# EAGLE design IEEEcounter (EAGLE 9.5.1)
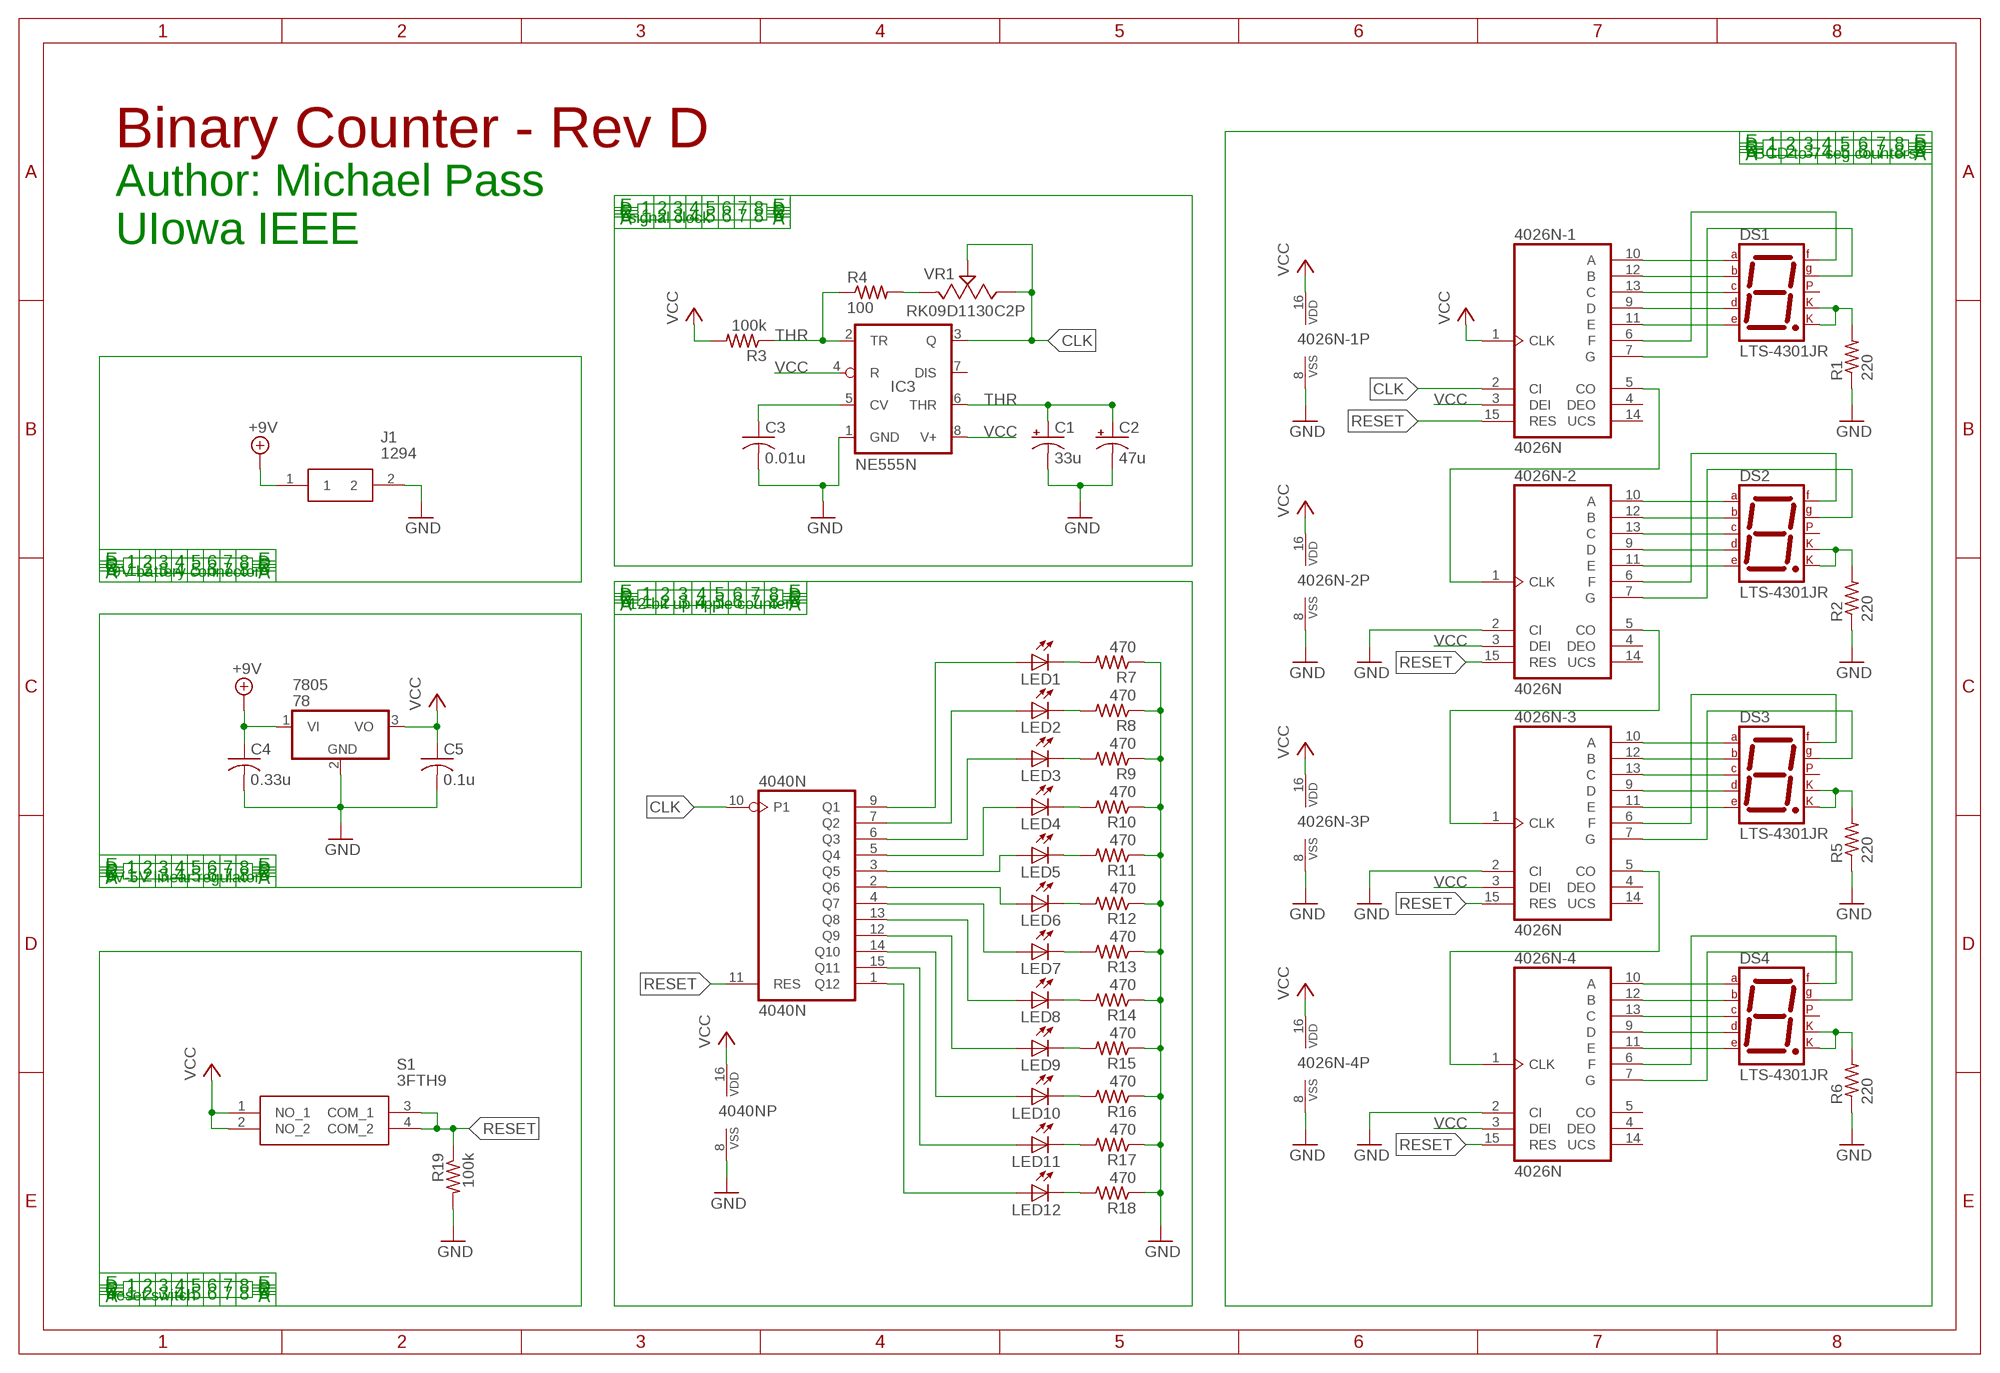
[diagram p0: schematic, sheet 1]

## Parts
4026N-1  4026N  [DIL16]
4026N-2  4026N  [DIL16]
4026N-3  4026N  [DIL16]
4026N-4  4026N  [DIL16]
4040N  4040N  [DIL16]
7805  78  [TO220H]
C1  33u  CPOL-USE2.5-6  [E2,5-6]
C2  47u  CPOL-USE2.5-6  [E2,5-6]
C3  0.01u  C-US050-025X075  [C050-025X075]
C4  0.33u  C-USC1210  [C1210]
C5  0.1u  C-USC1210  [C1210]
DS1  LTS-4301JR  [DIPS762W50P254L1290H700Q10N]
DS2  LTS-4301JR  [DIPS762W50P254L1290H700Q10N]
DS3  LTS-4301JR  [DIPS762W50P254L1290H700Q10N]
DS4  LTS-4301JR  [DIPS762W50P254L1290H700Q10N]
IC3  NE555N  [DIL08]
J1  1294  [1294]
LED1  LED5MM  [LED5MM]
LED2  LED5MM  [LED5MM]
LED3  LED5MM  [LED5MM]
LED4  LED5MM  [LED5MM]
LED5  LED5MM  [LED5MM]
LED6  LED5MM  [LED5MM]
LED7  LED5MM  [LED5MM]
LED8  LED5MM  [LED5MM]
LED9  LED5MM  [LED5MM]
LED10  LED5MM  [LED5MM]
LED11  LED5MM  [LED5MM]
LED12  LED5MM  [LED5MM]
R1  220  R-US_R1210  [R1210]
R2  220  R-US_R1210  [R1210]
R3  100k  R-US_R1210  [R1210]
R4  100  R-US_R1210  [R1210]
R5  220  R-US_R1210  [R1210]
R6  220  R-US_R1210  [R1210]
R7  470  R-US_R1210  [R1210]
R8  470  R-US_R1210  [R1210]
R9  470  R-US_R1210  [R1210]
R10  470  R-US_R1210  [R1210]
R11  470  R-US_R1210  [R1210]
R12  470  R-US_R1210  [R1210]
R13  470  R-US_R1210  [R1210]
R14  470  R-US_R1210  [R1210]
R15  470  R-US_R1210  [R1210]
R16  470  R-US_R1210  [R1210]
R17  470  R-US_R1210  [R1210]
R18  470  R-US_R1210  [R1210]
R19  100k  R-US_R1210  [R1210]
S1  3FTH9  [3FTH9]
VR1  RK09D1130C2P  [RK09D1130C3C]

## Nets
+9V: 7805.1(VI) C4.1 J1.1
CLK: 4026N-1.2(CI) 4040N.10(P1) IC3.3(Q) VR1.2 VR1.3
GND: 4026N-1.8(VSS) 4026N-2.2(CI) 4026N-2.8(VSS) 4026N-3.2(CI) 4026N-3.8(VSS) 4026N-4.2(CI) 4026N-4.8(VSS) 4040N.8(VSS) 7805.2(GND) C1.- C2.- C3.2 C4.2 C5.2 IC3.1(GND) J1.2 R1.1 R2.1 R5.1 R6.1 R7.1 R8.1 R9.1 R10.1 R11.1 R12.1 R13.1 R14.1 R15.1 R16.1 R17.1 R18.1 R19.2
N$1: 4026N-1.6(F) DS1.2(F)
N$2: 4026N-1.7(G) DS1.1(G)
N$3: 4026N-1.10(A) DS1.10(A)
N$4: 4026N-1.12(B) DS1.9(B)
N$5: 4026N-1.13(C) DS1.7(C)
N$6: 4026N-1.9(D) DS1.5(D)
N$7: 4026N-1.11(E) DS1.4(E)
N$8: DS1.3(CK1) DS1.8(CK2) R1.2
N$9: R4.2 VR1.1
N$10: C3.1 IC3.5(CV)
N$11: LED11.K(C) R17.2
N$12: 4040N.9(Q1) LED1.A
N$13: 4040N.7(Q2) LED2.A
N$14: 4040N.6(Q3) LED3.A
N$15: 4040N.5(Q4) LED4.A
N$16: LED12.K(C) R18.2
N$17: LED10.K(C) R16.2
N$18: LED9.K(C) R15.2
N$19: LED8.K(C) R14.2
N$20: LED7.K(C) R13.2
N$21: LED6.K(C) R12.2
N$22: LED5.K(C) R11.2
N$23: LED4.K(C) R10.2
N$24: LED3.K(C) R9.2
N$25: LED2.K(C) R8.2
N$26: LED1.K(C) R7.2
N$27: 4040N.3(Q5) LED5.A
N$28: 4040N.2(Q6) LED6.A
N$29: 4040N.4(Q7) LED7.A
N$30: 4040N.13(Q8) LED8.A
N$31: 4040N.12(Q9) LED9.A
N$32: 4040N.14(Q10) LED10.A
N$33: 4040N.15(Q11) LED11.A
N$34: 4040N.1(Q12) LED12.A
N$35: 4026N-2.6(F) DS2.2(F)
N$36: 4026N-2.7(G) DS2.1(G)
N$37: 4026N-2.10(A) DS2.10(A)
N$38: 4026N-2.12(B) DS2.9(B)
N$39: 4026N-2.13(C) DS2.7(C)
N$40: 4026N-2.9(D) DS2.5(D)
N$41: 4026N-2.11(E) DS2.4(E)
N$42: DS2.3(CK1) DS2.8(CK2) R2.2
N$43: 4026N-3.6(F) DS3.2(F)
N$44: 4026N-3.7(G) DS3.1(G)
N$45: 4026N-3.10(A) DS3.10(A)
N$46: 4026N-3.12(B) DS3.9(B)
N$47: 4026N-3.13(C) DS3.7(C)
N$48: 4026N-3.9(D) DS3.5(D)
N$49: 4026N-3.11(E) DS3.4(E)
N$50: DS3.3(CK1) DS3.8(CK2) R5.2
N$51: 4026N-4.6(F) DS4.2(F)
N$52: 4026N-4.7(G) DS4.1(G)
N$53: 4026N-4.10(A) DS4.10(A)
N$54: 4026N-4.12(B) DS4.9(B)
N$55: 4026N-4.13(C) DS4.7(C)
N$56: 4026N-4.9(D) DS4.5(D)
N$57: 4026N-4.11(E) DS4.4(E)
N$58: DS4.3(CK1) DS4.8(CK2) R6.2
N$59: 4026N-1.5(CO) 4026N-2.1(CLK)
N$60: 4026N-2.5(CO) 4026N-3.1(CLK)
N$61: 4026N-3.5(CO) 4026N-4.1(CLK)
RESET: 4026N-1.15(RES) 4026N-2.15(RES) 4026N-3.15(RES) 4026N-4.15(RES) 4040N.11(RES) R19.1 S1.3(COM_1) S1.4(COM_2)
THR: C1.+ C2.+ IC3.2(TR) IC3.6(THR) R3.1 R4.1
VCC: 4026N-1.1(CLK) 4026N-1.3(DEI) 4026N-1.16(VDD) 4026N-2.3(DEI) 4026N-2.16(VDD) 4026N-3.3(DEI) 4026N-3.16(VDD) 4026N-4.3(DEI) 4026N-4.16(VDD) 4040N.16(VDD) 7805.3(VO) C5.1 IC3.4(R) IC3.8(V+) R3.2 S1.1(NO_1) S1.2(NO_2)
Unconnected: 4026N-1.4(DEO) 4026N-1.14(UCS) 4026N-2.4(DEO) 4026N-2.14(UCS) 4026N-3.4(DEO) 4026N-3.14(UCS) 4026N-4.4(DEO) 4026N-4.5(CO) 4026N-4.14(UCS) DS1.6(DP) DS2.6(DP) DS3.6(DP) DS4.6(DP) IC3.7(DIS)

## Notes on the sheet
- Binary Counter - Rev D | BCD-to-7 seg counters
- Author: Michael Pass
- signal clock
- UIowa IEEE
- 9V battery connector
- 12-bit up ripple counter
- 9V-5V linear regulator
- reset switch

## Library data of the parts
4026N-1-4026N-4 = 40xx:4026: Decade COUNTER/DIVIDER, 7-seg. outputs
4040N = 40xx:4040: 12-stage binary/ripple COUNTER
7805 = IEEEcounter:78*
C1 C2 = rcl:CPOL-US: POLARIZED CAPACITOR, American symbol; SPICEPREFIX: C
C3-C5 = rcl:C-US: CAPACITOR, American symbol; SPICEPREFIX: C
DS1-DS4 = LTS-4301JR:LTS-4301JR: LED Displays & Accessories 1-DIG Red CCRHD Source: Datasheet <https://componentsearchengine.com/Datasheets/1/LTS-4301JR.pdf>; DESCRIPTION: LED Displays & Accessories 1-DIG Red CCRHD; HEIGHT: 7mm; MANUFACTURER_NAME: Lite-On; MANUFACTURER_PART_NUMBER: LTS-4301JR; MOUSER_PART_NUMBER: 859-LTS-4301JR; MOUSER_PRICE-STOCK: https://www.mouser.com/Search/Refine.aspx?Keyword=859-LTS-4301JR
IC3 = linear:*555: TIMER
J1 = 1294:1294: BATTERY HOLDER PP3 Keystone PCB Mount Battery Holder for 1, Solder Tag Contact Source: Datasheet <http://docs-emea.rs-online.com/webdocs/13d4/0900766b813d4cac.pdf>; ALLIED_NUMBER: 70182303; ALLIED_PRICE-STOCK: http://www.alliedelec.com/keystone-electronics-1294/70182303/; DESCRIPTION: BATTERY HOLDER PP3 Keystone PCB Mount Battery Holder for 1, Solder Tag Contact; HEIGHT: mm; MANUFACTURER_NAME: Keystone Electronics; MANUFACTURER_PART_NUMBER: 1294; MOUSER_PART_NUMBER: 534-1294; MOUSER_PRICE-STOCK: https://www.mouser.com/Search/Refine.aspx?Keyword=534-1294; RS_PART_NUMBER: 1725845; RS_PRICE-STOCK: http://uk.rs-online.com/web/p/products/1725845
LED1-LED12 = SparkFun:LED: LEDs Standard schematic elements and footprints for 5mm, 3mm, 1206, and 0603 sized LEDs. 5mm - Spark Fun Electronics SKU : COM-00529 (and others)
R1-R19 = rcl:R-US_: RESISTOR, American symbol; SPICEPREFIX: R
S1 = 3FTH9:3FTH9: IP67 Black Cap Tactile Switch, Single Pole Single Throw (SPST) 50 mA 4mm Through Hole Source: Datasheet <https://componentsearchengine.com/Datasheets/1/3FTH9.pdf>; DESCRIPTION: IP67 Black Cap Tactile Switch, Single Pole Single Throw (SPST) 50 mA 4mm Through Hole; HEIGHT: 10.4mm; MANUFACTURER_NAME: Apem; MANUFACTURER_PART_NUMBER: 3FTH9; MOUSER_PART_NUMBER: 642-3FTH9; MOUSER_PRICE-STOCK: https://www.mouser.com/Search/Refine.aspx?Keyword=642-3FTH9
VR1 = RK09D1130C2P:RK09D1130C2P: Alps Electric 1 Gang Rotary Potentiometer with a 6 mm Dia. Shaft, 10k, +/-20%, 0.05W, Linear RK09D1130C2P Source: Datasheet <https://www.alps.com/prod/info/E/HTML/Potentiometer/RotaryPotentiometers/RK09K/RK09D1130C2P.html>; ALLIED_NUMBER: R1075936; ALLIED_PRICE-STOCK: https://www.alliedelec.com/alps-rk09d1130c2p/R1075936/; DESCRIPTION: Alps Electric 1 Gang Rotary Potentiometer with a 6 mm Dia. Shaft, 10k, +/-20%, 0.05W, Linear RK09D1130C2P; HEIGHT: mm; MANUFACTURER_NAME: ALPS; MANUFACTURER_PART_NUMBER: RK09D1130C2P; MOUSER_PART_NUMBER: 688-RK09D1130C2P; MOUSER_PRICE-STOCK: https://www.mouser.com/Search/Refine.aspx?Keyword=688-RK09D1130C2P; RS_PART_NUMBER: 1726272; RS_PRICE-STOCK: http://uk.rs-online.com/web/p/products/1726272

## Board
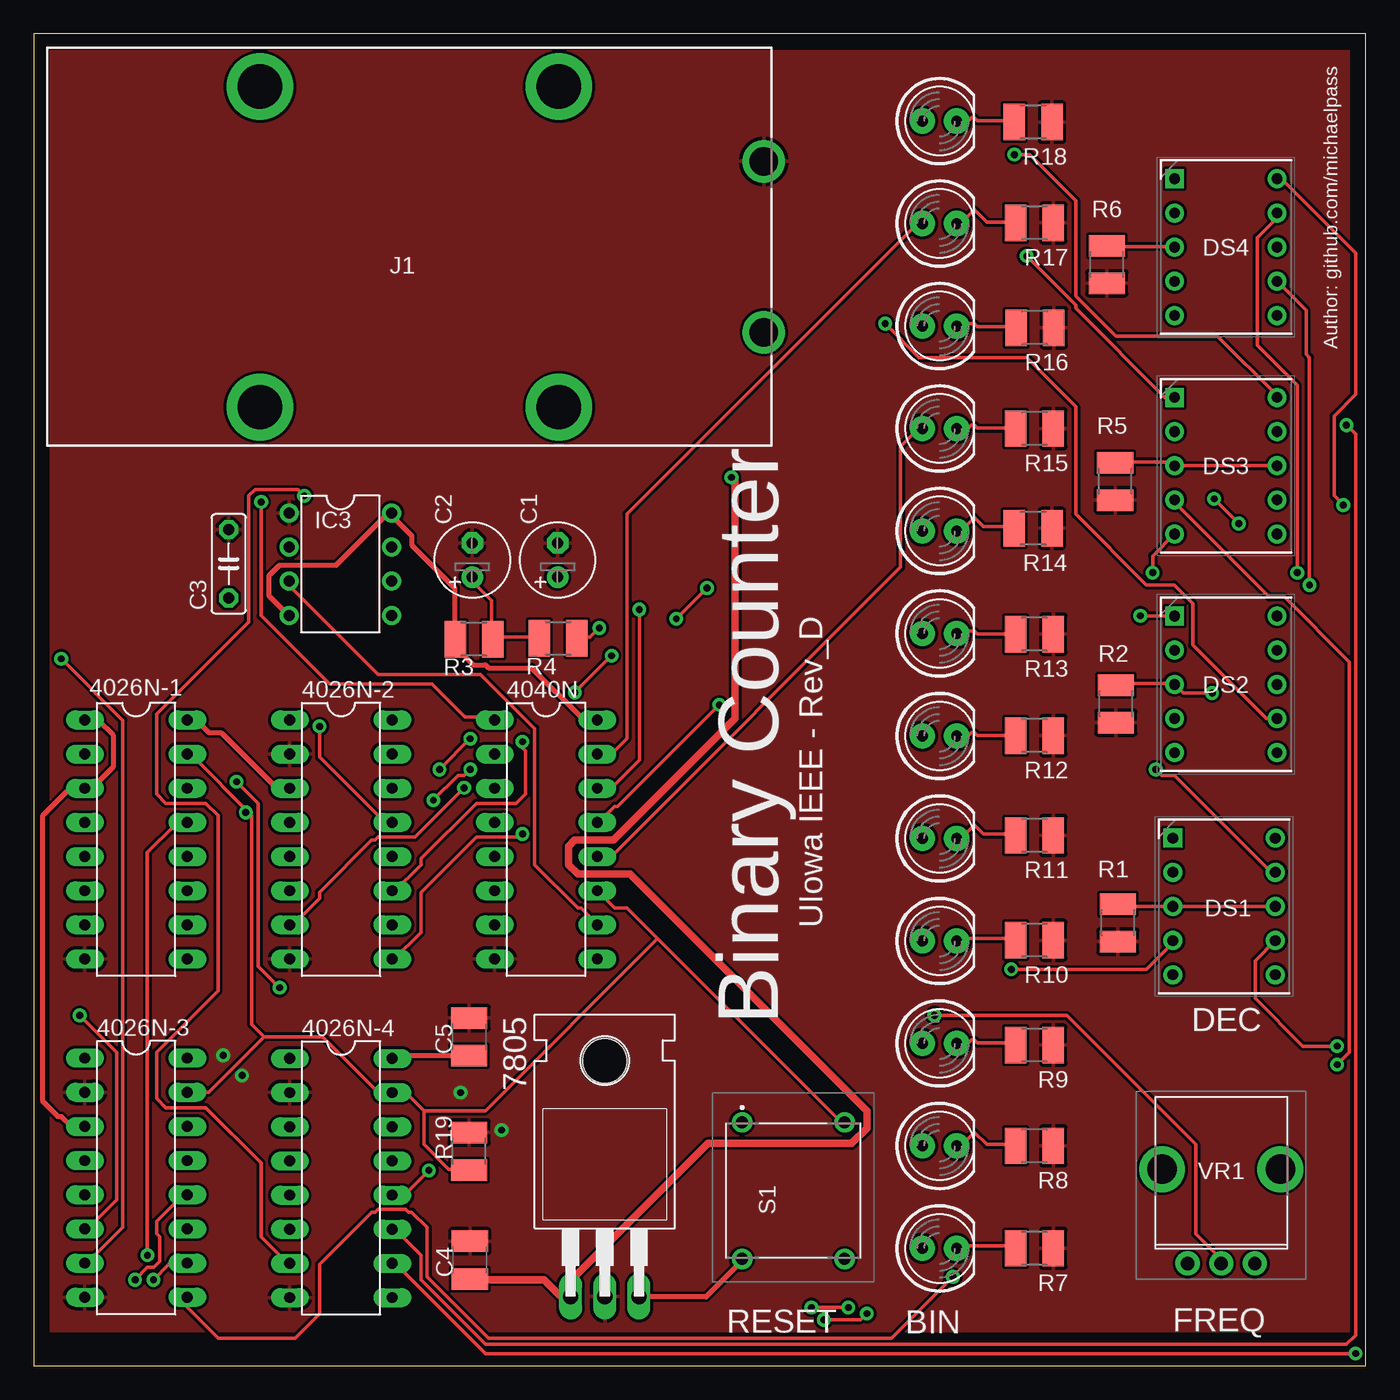
[diagram p1: board, top side]
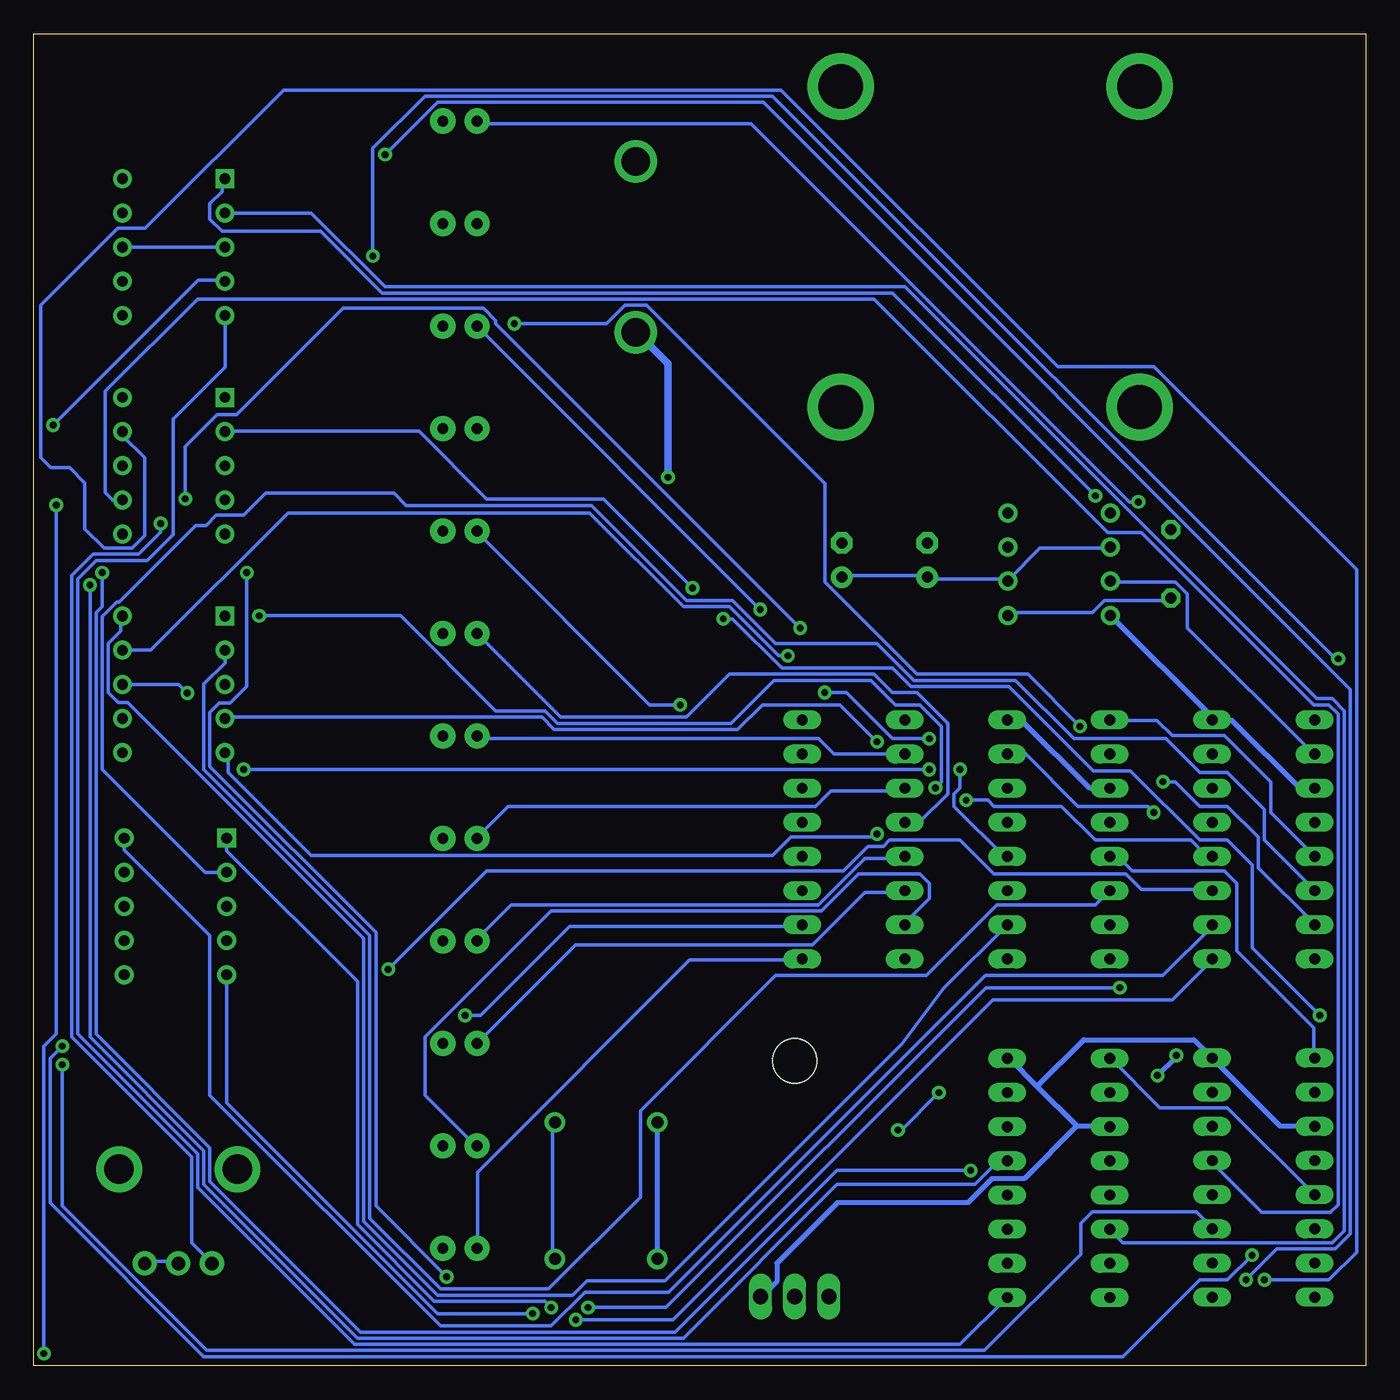
[diagram p2: board, bottom side, seen from below]

Size 99.06 x 99.06 mm. Coordinates in mm from the lower left corner, seen from the top.
Outline: 0,0 99.06,0 99.06,99.06 0,99.06 0,0
Copper layers (1*16): Top 0.035mm / dielectric 1.5mm / Bottom 0.035mm
Design rules "SparkFun *": minimum track width 10mil, minimum drill 20mil, track to track 8mil, track to pad 8mil, pad to pad 8mil, via to via 8mil, smd to smd 8mil, copper to edge 10mil, drill to drill 8mil, minimum pad ring 12mil, minimum via ring 10mil, stop-mask expansion 4mil, vias tented up to drill 25mil, thermal gap 10mil

### Footprints (pad centres in the part's own frame; a part is rotated, then mirrored left to right if it is on the bottom)
DIL16 = drill 0.813 long: 1 -8.89,-3.81; 2 -6.35,-3.81; 3 -3.81,-3.81; 4 -1.27,-3.81; 5 1.27,-3.81; 6 3.81,-3.81; 7 6.35,-3.81; 8 8.89,-3.81; 9 8.89,3.81; 10 6.35,3.81; 11 3.81,3.81; 12 1.27,3.81; 13 -1.27,3.81; 14 -3.81,3.81; 15 -6.35,3.81; 16 -8.89,3.81
TO220H = drill 1.118 long: 1 -2.54,-12.7; 2 0,-12.7; 3 2.54,-12.7 | hole 3.302: 0,4.826
E2,5-6 = drill 0.813 pad 1.6: + -1.27,0 | drill 0.813 pad 1.6 octagon: - 1.27,0
C050-025X075 = drill 0.813 octagon: 1 -2.54,0; 2 2.54,0
C1210 = smd 1.6 x 2.7: 1 -1.4,0; 2 1.4,0
DIPS762W50P254L1290H700Q10N = drill 0.8 pad 1.2 square: 1 0,0 | drill 0.8 pad 1.2: 2 0,-2.54; 3 0,-5.08; 4 0,-7.62; 5 0,-10.16; 6 7.62,-10.16; 7 7.62,-7.62; 8 7.62,-5.08; 9 7.62,-2.54; 10 7.62,0
DIL08 = drill 0.813 pad 1.27: 1 -3.81,-3.81; 2 -1.27,-3.81; 3 1.27,-3.81; 4 3.81,-3.81; 5 3.81,3.81; 6 1.27,3.81; 7 -1.27,3.81; 8 -3.81,3.81
1294 = drill 2.11 pad 3.16: 1 -26.355,18.265; 2 -26.355,5.565 | drill 3.3 pad 4.95: 3 -11.115,23.83; 4 -11.115,0; 5 11.115,23.83; 6 11.115,0
LED5MM = drill 0.813 pad 1.88: A -1.27,0; K 1.27,0
R1210 = smd 1.6 x 2.7: 1 -1.4,0; 2 1.4,0
3FTH9 = drill 0.9 pad 1.4: 1 0,0; 2 -10.16,0; 3 0,-7.62; 4 -10.16,-7.62
RK09D1130C3C = drill 1 pad 1.8: 1 0,0; 2 2.5,0; 3 5,0 | drill 2.2 pad 3.4: 4 -1.9,7; 5 6.9,7

### Placement (x,y rotation side)
4026N-1  7.62,39.14 270 top
4026N-2  22.86,39.14 270 top
4026N-3  7.62,14 270 top
4026N-4  22.86,13.97 270 top
4040N  38.1,39.14 270 top
7805  42.47,17.86 0 top
C1  38.96,59.92 90 top
C2  32.61,59.92 90 top
C3  14.5,59.64 90 top
C4  32.44,7.87 90 top
C5  32.38,24.46 90 top
DS1  84.71,39.24 0 top
DS2  84.84,55.75 0 top
DS3  84.84,72.01 0 top
DS4  84.84,88.27 0 top
IC3  22.81,59.61 270 top
J1  27.94,95.12 180 top
LED1  67.36,8.74 0 top
LED2  67.36,16.36 0 top
LED3  67.36,23.98 0 top
LED4  67.36,31.6 0 top
LED5  67.36,39.22 0 top
LED6  67.36,46.84 0 top
LED7  67.36,54.46 0 top
LED8  67.36,62.08 0 top
LED9  67.36,69.7 0 top
LED10  67.36,77.32 0 top
LED11  67.36,84.94 0 top
LED12  67.36,92.56 0 top
R1  80.62,32.94 90 top
R2  80.47,49.23 90 top
R3  32.74,54.03 180 top
R4  38.99,54.1 0 top
R5  80.42,65.76 90 top
R6  79.81,81.89 90 top
R7  74.42,8.74 180 top
R8  74.42,16.36 180 top
R9  74.42,23.85 180 top
R10  74.42,31.65 180 top
R11  74.42,39.45 180 top
R12  74.42,46.86 180 top
R13  74.42,54.41 180 top
R14  74.32,62.28 180 top
R15  74.42,69.7 180 top
R16  74.45,77.19 180 top
R17  74.42,84.99 180 top
R18  74.32,92.48 180 top
R19  32.38,15.95 90 top
S1  52.68,18.11 90 top
VR1  85.8,7.62 0 top

### Tracks (layer width: path | path; a pad name or v marks a point on that pad's centre or on a via)
+9V  (via drill 0.51)
  Top 0.559: C4.1 32.46,6.4 37.95,6.4 39.09,5.26 39.78,5.26 7805.1 40.01,5.26 40.01,6.4 50.14,16.54 60.81,16.54 61.95,17.68 61.95,18.97 44.35,36.58 43.2,36.58 40.46,36.58 39.78,37.26 39.78,38.63 40.23,39.09 43.1,39.09 52.15,48.13 52.15,65.81 v51.89,66.06
  Bottom 0.559: v51.89,66.06 51.89,74.52 54.18,76.81 J1.1
CLK  (via drill 0.51)
  Top 0.254: 4040N.10 41.83,32.92 40.69,34.06 40.46,34.06 37.26,37.26 37.26,47.4 33.25,51.41 25.63,51.41 19.2,57.84 19.2,58.29 IC3.3 | v66.98,26.06 76.81,26.06 86.41,16.46 86.41,9.83 88.24,8 88.24,7.77 VR1.2
  Bottom 0.254: VR1.2 88.47,7.77 90.75,7.77 VR1.3 | 4026N-1.2 3.89,45.49 13.26,54.86 13.26,57.38 14.17,58.29 18.97,58.29 IC3.3 | v66.98,26.06 65.84,26.06 59.21,32.69 42.06,32.69 4040N.10
GND  (via drill 0.51)
  Bottom 0.254: v31.75,20.32 34.54,17.53 v34.8,17.53
  Bottom 0.356: v15.49,21.59 14.1,22.99 v14.1,23.09
  pour Top: 1.27,97.79 97.79,97.79 97.79,2.54 1.27,2.54
N$1
  Bottom 0.254: 4026N-1.6 3.89,35.43 7.54,39.09 7.54,41.38 10.29,44.12 12.34,44.12 14.86,46.63 21.72,46.63 26.06,50.98 33.6,50.98 36.35,53.72 43.89,53.72 47.09,56.92 50.52,56.92 57.58,63.98 71.35,63.98 72.26,64.89 81.79,64.89 83.44,63.25 85.47,63.25 86.23,62.48 87,62.48 92.69,56.79 92.89,56.79 93.95,55.72 93.95,44.35 86.31,36.7 DS1.2
N$2  (via drill 0.51)
  Top 0.254: v57.84,4.34 v60.58,4.34 | v18.29,28.12 16.69,29.72 16.69,41.83 v15.09,43.43
  Bottom 0.254: v60.58,4.34 61.04,4.8 69.27,4.8 74.98,10.52 74.98,28.57 84.71,38.3 DS1.1 | v57.84,4.34 52.05,4.34 28.27,28.12 v18.29,28.12 | v15.09,43.43 14.17,43.43 12.34,41.6 10.29,41.6 8,39.32 8,37.03 3.89,32.92 4026N-1.7
N$3
  Bottom 0.254: 4026N-1.10 11.43,32.69 15.09,29.03 28.3,29.03 51.84,5.49 58.06,5.49 60.58,2.97 68.81,2.97 85.95,20.12 85.95,32 92.33,38.38 DS1.10
N$4  (via drill 0.51)
  Top 0.254: v83.44,44.35 83.9,43.89 84.84,43.89 92.02,36.7 DS1.9 | v32.46,44.35 32,43.89 31.55,43.89 v29.72,42.06
  Bottom 0.254: v32.46,44.35 v83.44,44.35 | v29.72,42.06 28.12,42.06 27.66,41.6 22.63,41.6 20.12,39.09 13.03,39.09 11.89,37.95 11.43,37.95 4026N-1.12
N$5  (via drill 0.51)
  Top 0.254: v96.93,23.77 94.39,23.77 90.83,27.33 90.83,30.12 DS1.7 | v8.46,8.23 8.46,38.18 10.52,40.23 11.43,40.23 4026N-1.13
  Bottom 0.254: v96.93,23.77 97.84,22.86 97.84,12.12 86.41,0.69 18.06,0.69 12.34,6.4 10.29,6.4 v8.46,8.23
N$6  (via drill 0.51)
  Top 0.254: v61.95,3.89 61.49,3.43 v58.75,3.43
  Bottom 0.254: v61.95,3.89 69.04,3.89 84.71,19.56 DS1.5 | v58.75,3.43 51.51,3.43 27.74,27.2 14.4,27.2 11.43,30.18 4026N-1.9
N$7  (via drill 0.51)
  Top 0.254: v72.69,29.49 82.75,29.49 84.71,31.45 DS1.4
  Bottom 0.254: v72.69,29.49 65.38,36.8 38.86,36.8 37.03,38.63 35.89,38.63 35.43,39.09 30.18,39.09 27.66,36.58 17.83,36.58 16.69,35.43 11.43,35.43 4026N-1.11
N$8
  Top 0.254: R1.2 80.88,34.16 DS1.3 DS1.8
N$9  (via drill 0.51)
  Top 0.254: v42.06,54.86 41.38,54.18 40.46,54.18 R4.2 | v89.61,62.64 v87.78,64.47
  Bottom 0.254: v42.06,54.86 64.69,77.5 64.69,77.72 65.61,78.64 76.05,78.64 83.95,70.74 85.39,70.74 87.78,68.35 v87.78,64.47 | v89.61,62.64 89.61,62 91.26,60.35 94.64,60.35 96.24,58.75 96.24,24.46 87.33,15.54 87.33,9.14 VR1.1
N$10
  Bottom 0.254: IC3.5 26.52,56.01 20.34,56.01 19.43,56.92 14.63,56.92 C3.1
N$11
  Top 0.254: R17.2 72.92,85.04 70.87,85.04 69.95,85.95 68.81,84.81 LED11.K
N$12
  Bottom 0.254: 4040N.9 42.06,30.18 50.29,30.18 66.06,14.4 66.06,8.91 LED1.A
N$13
  Bottom 0.254: 4040N.7 34.29,32.92 32.46,34.75 32.46,35.89 33.15,36.58 37.72,36.58 40.46,33.83 60.58,33.83 69.95,24.46 69.95,20.12 66.29,16.46 LED2.A
N$14
  Bottom 0.254: LED3.A 58.75,31.32 41.15,31.32 37.26,35.2 34.29,35.2 4040N.6
N$15
  Bottom 0.254: 4040N.5 34.29,37.72 37.26,37.72 40.69,34.29 63.55,34.29 66.06,31.77 LED4.A
N$16
  Top 0.254: R18.2 72.69,92.58 70.18,92.58 69.95,92.81 69.72,92.81 69.49,92.58 68.81,92.58 LED12.K
N$17
  Top 0.254: R16.2 72.92,77.27 70.18,77.27 69.95,77.5 68.81,77.5 LED10.K
N$18
  Top 0.254: R15.2 72.92,69.72 70.18,69.72 69.95,69.95 69.72,69.95 69.49,69.72 68.81,69.72 LED9.K
N$19
  Top 0.254: R14.2 72.69,62.41 70.64,62.41 69.95,63.09 68.81,61.95 LED8.K
N$20
  Top 0.254: R13.2 70.18,54.41 69.95,54.63 68.81,54.63 LED7.K
N$21
  Top 0.254: R12.2 70.18,46.86 69.95,47.09 69.72,47.09 69.49,46.86 68.81,46.86 LED6.K
N$22
  Top 0.254: R11.2 72.92,39.55 70.64,39.55 69.95,40.23 68.81,39.09 LED5.K
N$23
  Top 0.254: R10.2 72.92,31.77 68.81,31.77 LED4.K
N$24
  Top 0.254: R9.2 72.92,24 70.18,24 69.95,24.23 69.72,24.23 69.49,24 68.81,24 LED3.K
N$25
  Top 0.254: R8.2 72.92,16.46 70.87,16.46 69.95,17.37 68.81,16.23 LED2.K
N$26
  Top 0.254: R7.2 72.92,8.91 68.81,8.91 LED1.K
N$27
  Bottom 0.254: 4040N.3 34.29,42.75 39.78,42.75 40.92,41.6 63.78,41.6 66.06,39.32 LED5.A
N$28
  Bottom 0.254: 4040N.2 39.55,45.49 40.69,46.63 66.06,46.63 LED6.A
N$29
  Bottom 0.254: 4040N.4 34.29,40.46 33.15,40.46 31.09,42.52 31.09,47.78 33.38,50.06 35.2,50.06 36.58,51.44 47.32,51.44 50.52,48.23 59.89,48.23 66.06,54.41 LED7.A
N$30  (via drill 0.51)
  Top 0.254: v50.98,49.15 43.43,41.6 43.2,41.6 42.06,40.46 4040N.13
  Bottom 0.254: v50.98,49.15 53.26,49.15 66.06,61.95 LED8.A
N$31
  Top 0.254: 4040N.12 41.96,37.82 42.9,37.82 64.47,59.38 64.47,68.35 65.61,69.49 66.06,69.49 LED9.A
N$32  (via drill 0.51)
  Top 0.254: v45.03,56.24 45.03,45.03 42.98,42.98 42.06,42.98 4040N.14
  Bottom 0.254: v45.03,56.24 66.06,77.27 LED10.A
N$33
  Top 0.254: 4040N.15 42.98,45.49 44.12,46.63 44.12,63.32 65.61,84.81 66.06,84.81 LED11.A
N$34  (via drill 0.51)
  Top 0.254: v16.92,64.24 16.92,55.78 22,50.7 29.62,50.7 32.08,48.23 34.29,48.23 4040N.1
  Bottom 0.254: v16.92,64.24 17.6,64.24 45.72,92.35 66.06,92.35 LED12.A
N$35
  Bottom 0.254: 4026N-2.6 19.2,35.2 20.12,34.29 27.43,34.29 32.69,29.03 43.89,29.03 53.95,18.97 53.95,12.52 60.76,5.71 68.81,5.71 74.07,10.97 74.07,32 86.41,44.35 86.41,50.7 84.84,52.27 84.84,53.01 DS2.2
N$36  (via drill 0.51)
  Top 0.254: v32,42.98 28.35,39.32 25.6,39.32 25.38,39.09 25.15,39.09 21.26,35.2 21.26,34.75 19.2,32.69 4026N-2.7 | DS2.1 84.78,55.75 82.32,55.75 v82.3,55.78
  Bottom 0.254: v82.3,55.78 71.78,55.78 64.69,48.69 61.04,48.69 60.12,47.78 47.19,47.78 43.99,50.98 36.8,50.98 34.98,49.15 33.15,49.15 31.55,47.55 31.55,43.43 v32,42.98
N$37
  Bottom 0.254: 4026N-2.10 31.37,28.09 34.49,23.93 52.09,6.33 57.91,6.33 58.98,5.26 69.04,5.26 74.52,10.74 74.52,31.77 92.08,49.33 92.76,49.33 93.5,50.06 93.5,53.72 92.58,54.63 92.58,55.63 DS2.10
N$38  (via drill 0.51)
  Top 0.254: v40.23,50.06 v42.98,52.81 | v30.18,44.35 v32.46,46.63
  Bottom 0.254: DS2.9 90.35,53.21 80.14,63.42 57.71,63.42 50.75,56.46 47.32,56.46 43.66,52.81 v42.98,52.81 | v40.23,50.06 38.63,50.06 35.2,46.63 v32.46,46.63 | v30.18,44.35 30.18,42.98 30.63,42.52 30.63,41.6 26.75,37.72 4026N-2.12
N$39  (via drill 0.51)
  Top 0.254: v63.32,77.5 65.84,74.98 73.84,74.98 77.5,71.32 77.5,63.32 82.75,58.06 84.81,58.06 86.18,56.69 86.18,53.59 91.64,48.13 DS2.7 | v21.26,47.55 21.26,45.26 26.06,40.46 26.52,40.46 4026N-2.13
  Bottom 0.254: v63.32,77.5 56.46,77.5 55.09,78.87 53.49,78.87 40.23,65.61 40.23,58.29 33.38,51.44 25.15,51.44 v21.26,47.55
N$40  (via drill 0.51)
  Top 0.254: v36.35,39.55 36.12,39.32 32.92,39.32 28.8,35.2 28.8,32.23 26.75,30.18 4026N-2.9
  Bottom 0.254: v36.35,39.55 36.58,39.32 42.75,39.32 44.12,37.95 78.41,37.95 84.58,44.12 84.58,45.49 84.68,45.59 DS2.5
N$41  (via drill 0.51)
  Top 0.254: v36.35,46.41 36.35,45.95 36.58,45.72 36.58,42.52 35.89,41.83 32.92,41.83 28.8,37.72 28.8,37.26 26.75,35.2 4026N-2.11
  Bottom 0.254: v36.35,46.41 39.09,49.15 44.88,49.15 46.71,47.32 60.35,47.32 61.27,48.23 84.73,48.23 DS2.4
N$42  (via drill 0.51)
  Top 0.254: R2.2 80.47,50.75 84.76,50.75 DS2.3 85.47,50.04 v87.63,50.04
  Bottom 0.254: v87.63,50.04 88.27,50.67 DS2.8
N$43  (via drill 0.51)
  Top 0.254: v47.78,55.55 v50.06,57.84 | v3.43,26.06 6.17,23.32 6.17,12.34 3.89,10.06 4026N-3.6
  Bottom 0.254: v50.06,57.84 56.69,64.47 65.38,64.47 70.41,69.49 84.66,69.49 84.81,69.49 DS3.2 | v47.78,55.55 47.09,55.55 43.43,51.89 35.2,51.89 33.83,50.52 26.54,50.52 20.27,44.25 17.5,44.25 12.34,39.09 10.29,39.09 8.46,37.26 8.46,31.09 v3.43,26.06
N$44  (via drill 0.51)
  Top 0.254: DS3.1 84.12,72.01 77.5,78.64 77.5,78.87 v73.84,82.53 | v2.06,52.58 6.63,48.01 6.63,10.29 3.89,7.54 4026N-3.7
  Bottom 0.254: v73.84,82.53 73.84,90.53 69.95,94.41 44.12,94.41 2.29,52.58 v2.06,52.58
N$45  (via drill 0.51)
  Top 0.254: v72.92,90.07 74.07,90.07 77.5,86.64 77.5,79.55 80.47,76.58 88.01,76.58 92.46,72.14 DS3.10 | v8.91,6.4 10.06,7.54 11.43,7.54 4026N-3.10
  Bottom 0.254: v72.92,90.07 69.04,93.95 44.81,93.95 1.14,50.29 1.14,9.83 2.29,8.69 6.63,8.69 v8.91,6.4
N$46  (via drill 0.51)
  Top 0.254: v7.54,6.4 8.46,7.32 8.91,7.32 9.37,7.77 9.37,9.6 9.14,9.83 9.14,10.74 10.97,12.57 11.43,12.57 4026N-3.12
  Bottom 0.254: DS3.9 92.46,69.19 90.81,67.54 90.81,61.75 91.75,60.81 92.81,60.81 93.83,60.81 95.25,62.23 95.25,65.66 96.39,66.8 97.79,66.8 98.53,67.54 98.53,78.87 92.81,84.58 90.75,84.58 80.47,94.87 43.48,94.87 22.91,74.3 15.77,74.3 0.69,59.21 0.69,8.46 2.74,6.4 v7.54,6.4
N$47
  Bottom 0.254: 4026N-3.13 11.43,15.09 7.75,11.4 2.64,11.4 2.06,11.99 2.06,48.46 2.74,49.15 3.89,49.15 16.69,61.95 19.2,61.95 36.58,79.32 86.87,79.32 93.73,72.47 93.73,64.95 93.17,64.39 DS3.7
N$48  (via drill 0.51)
  Top 0.254: v68.35,6.63 63.78,2.06 33.83,2.06 29.26,6.63 29.26,10.29 28.12,11.43 27.89,11.43 27.66,11.66 25.6,11.66 25.38,11.43 25.15,11.43 21.26,7.54 21.26,3.89 19.43,2.06 13.72,2.06 11.43,4.34 4026N-3.9 | DS3.5 83.21,60.22 v83.21,58.98
  Bottom 0.254: v83.21,58.98 83.21,50.52 84.45,49.28 85.27,49.28 85.95,48.59 85.95,44.58 73.61,32.23 73.61,11.89 v68.35,6.63
N$49  (via drill 0.51)
  Top 0.254: v96.93,22.4 97.84,23.32 97.84,52.35 93.04,57.15 91.9,57.15 84.91,64.14 84.91,64.31 DS3.4
  Bottom 0.254: v96.93,22.4 96.93,11.89 86.18,1.14 28.35,1.14 21.18,8.31 21.18,10.62 20.34,11.46 12.6,11.46 11.43,10.29 4026N-3.11
N$50
  Top 0.254: R5.2 80.47,67.21 84.56,67.21 DS3.3 DS3.8
N$51
  Bottom 0.254: 4026N-4.6 18.97,10.06 18.06,9.14 2.52,9.14 1.6,10.06 1.6,48.69 2.52,49.61 3.66,49.61 34.29,80.24 72.92,80.24 78.41,85.72 DS4.2
N$52  (via drill 0.51)
  Top 0.254: v20.12,64.69 19.66,65.15 16.46,65.15 16,64.69 16,55.32 9.14,48.46 9.14,42.52 9.83,41.83 12.8,41.83 13.72,40.92 13.72,27.89 9.14,23.32 9.14,19.89 9.83,19.2 12.8,19.2 16.92,15.09 16.92,9.6 18.97,7.54 4026N-4.7
  Bottom 0.254: v20.12,64.69 35.2,79.78 73.15,79.78 77.72,84.35 85.04,84.35 85.95,85.27 85.95,86.41 85.04,87.33 85.04,88.06 DS4.1
N$53  (via drill 0.51)
  Top 0.254: v97.38,64.01 96.7,64.69 96.7,70.64 98.3,72.24 98.3,82.75 92.81,88.24 92.46,88.24 DS4.10 | v98.3,0.91 33.6,0.91 26.75,7.77 4026N-4.10
  Bottom 0.254: v97.38,64.01 97.38,24.69 98.3,23.77 v98.3,0.91
N$54  (via drill 0.51)
  Top 0.254: v93.95,58.98 93.95,72.92 90.98,75.89 90.98,83.9 92.46,85.37 92.46,85.55 DS4.9 | v29.39,14.53 27.66,12.8 26.75,12.8 4026N-4.12
  Bottom 0.254: v93.95,58.98 93.95,56.46 94.41,56.01 94.41,24.69 85.95,16.23 85.95,13.72 74.75,2.52 51.36,2.52 39.34,14.53 v29.39,14.53
N$55  (via drill 0.51)
  Top 0.254: v94.87,58.06 94.87,74.98 94.61,75.23 94.61,78.49 DS4.7
  Bottom 0.254: v94.87,58.06 94.87,24.46 86.41,16 86.41,13.49 74.98,2.06 50.75,2.06 39.32,13.49 29.06,13.49 27.46,15.09 26.75,15.09 4026N-4.13
N$56
  Bottom 0.254: 4026N-4.9 26.75,5.03 30.18,1.6 75.21,1.6 86.87,13.26 86.87,15.77 95.78,24.69 95.78,58.52 94.41,59.89 90.6,59.89 88.7,61.8 88.7,70.41 84.84,74.27 DS4.5
N$57  (via drill 0.51)
  Top 0.254: v97.61,69.95 98.3,69.27 98.3,2.29 97.61,1.6 33.6,1.6 28.8,6.4 28.8,8.23 26.75,10.29 4026N-4.11
  Bottom 0.254: v97.61,69.95 86.84,80.72 84.91,80.72 DS4.4
N$58
  Top 0.254: R6.2 80.01,83.21 84.81,83.21 DS4.3
  Bottom 0.254: DS4.3 DS4.8
N$59
  Bottom 0.254: 4026N-1.5 7.09,41.15 7.09,43.43 10.52,46.86 14.4,46.86 15.54,48.01 18.97,48.01 4026N-2.1
N$60
  Bottom 0.254: 4026N-3.1 3.89,23.09 3.89,25.15 9.6,30.86 9.6,35.89 10.52,36.8 17.37,36.8 18.29,37.72 18.97,37.72 4026N-2.5
N$61
  Bottom 0.254: 4026N-3.5 10.29,19.2 15.32,19.2 18.97,22.86 4026N-4.1
RESET  (via drill 0.51)
  Top 0.254: 46.41,31.77 59.66,18.52 59.93,18.48 S1.3 | 46.41,31.77 44.12,34.06 43.2,34.06 42.06,35.2 4040N.11 | 29.03,18.97 29.03,16.46 30.86,14.63 32.23,14.63 R19.1 | 29.03,18.97 27.89,20.12 26.75,20.12 4026N-4.15 26.52,20.34 25.6,20.34 21.49,24.46 17.14,24.46 | 4026N-3.15 13.03,20.34 17.14,24.46 | 4026N-1.15 11.89,45.03 12.12,45.03 15.77,41.38 | 15.77,41.38 16.23,40.92 16.23,25.38 17.14,24.46 | 15.77,41.38 v15.77,41.15 | 46.41,31.77 33.6,18.97 29.03,18.97
  Bottom 0.254: S1.3 60.48,17.4 60.48,8.51 60.3,8.33 S1.4 | 4026N-2.15 25.3,45.49 21.41,41.6 16.23,41.6 v15.77,41.15
THR
  Top 0.254: R4.1 37.49,54.18 34.29,54.18 R3.1 34.06,54.18 34.06,56.92 32.46,58.52 C2.+
  Bottom 0.254: IC3.2 19.2,60.81 24.23,60.81 26.52,58.52 IC3.6 26.75,58.52 32.46,58.52 C2.+ 32.69,58.75 38.86,58.75 C1.+
VCC
  Top 0.356: 26.52,63.32 28.12,61.72 28.12,61.04 31.32,57.84 31.32,54.18 R3.2 31.55,53.95 31.55,53.26 32.69,52.12 33.6,52.12 33.83,51.89 37.03,51.89 40.69,48.23 41.83,48.23 4040N.16 | 4026N-1.1 3.89,48.01 4.8,48.01 5.94,46.86 5.94,44.58 4.34,42.98 3.89,42.98 4026N-1.3 3.66,42.75 2.52,42.75 0.69,40.92 0.69,19.66 1.83,18.52 2.06,18.52 2.74,17.83 3.66,17.83 4026N-3.3 | 4026N-2.3 18.97,42.98 18.06,42.98 13.95,47.09 13.03,47.09 12.12,48.01 11.43,48.01 4026N-1.16 | 26.52,63.32 26.29,63.32 22.5,59.54 18.29,59.54 17.5,58.75 17.5,57.25 18.97,55.78 IC3.4 | 26.52,63.32 IC3.8 | 7805.3 45.03,5.13 50.01,5.13 52.68,7.8 S1.2 | C5.1 32.23,23.09 26.98,23.09 26.75,22.86 4026N-4.16
  Bottom 0.356: 4026N-2.3 19.2,42.98 20.57,42.98 25.6,48.01 26.52,48.01 4026N-2.16 | 4026N-1.3 3.89,42.98 4.93,42.98 9.96,48.01 11.43,48.01 4026N-1.16 11.43,48.23 IC3.4 | 4026N-3.3 3.89,17.83 6.4,17.83 11.43,22.86 4026N-3.16 12.8,24.26 20.98,24.26 24.45,20.79 | 21.49,17.83 19.2,17.83 4026N-4.3 | 24.45,20.79 26.52,22.86 4026N-4.16 | 24.45,20.79 21.49,17.83 | 21.49,17.83 25.4,13.92 27.81,13.92 29.59,12.14 39.29,12.14 43.79,7.64 43.79,6.27 44.81,5.26 7805.3 | S1.2 S1.1

### Text on the board
tNames: Author: github.com/michaelpass | UIowa IEEE - Rev_D | Binary Counter | DEC | FREQ | RESET | BIN